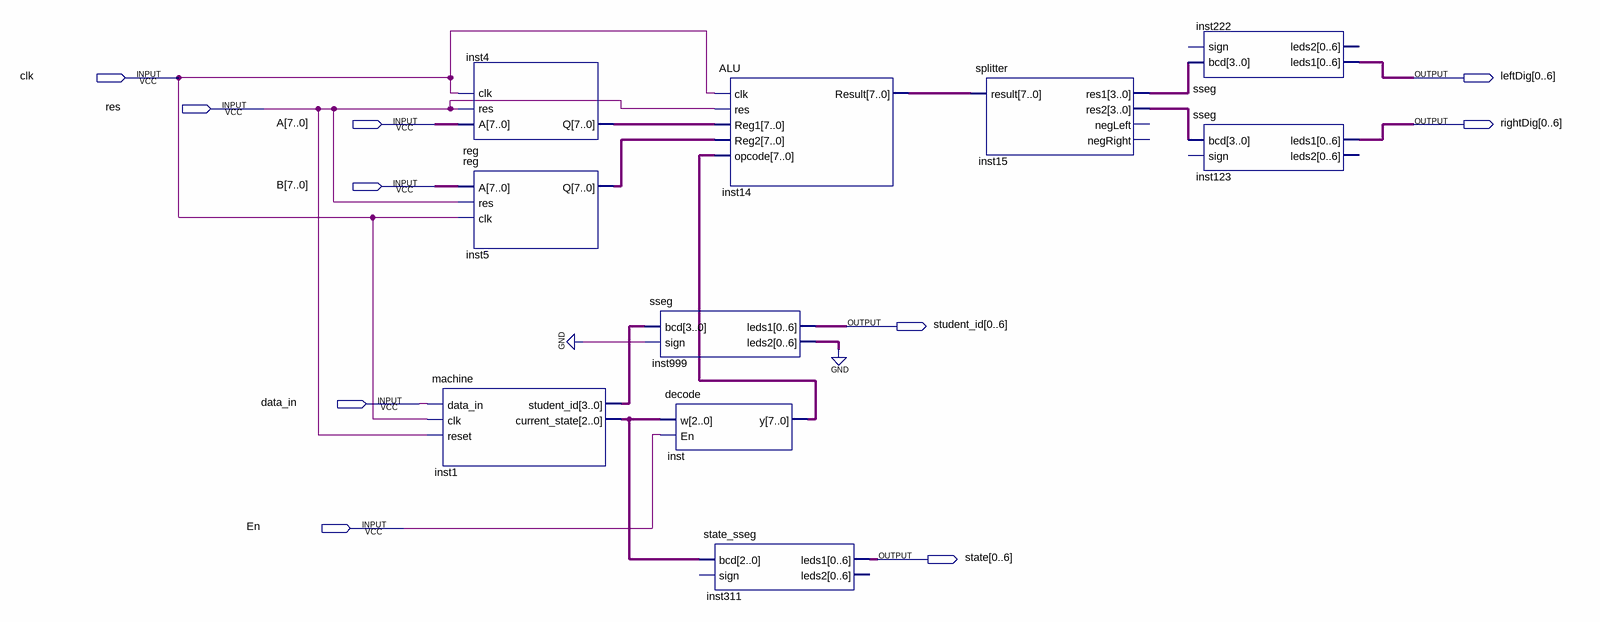
[diagram p0: schematic sheet]
// Quartus schematic CPU.bdf as structural Verilog: 10 symbols, 10 pins
module CPU (
  input  clk,
  input  res,
  input  [7:0] A,
  input  [7:0] B,
  input  data_in,
  input  En,
  output [0:6] leftDig,
  output [0:6] rightDig,
  output [0:6] student_id,
  output [0:6] state
);

  wire [2:0] inst1_current_state;
  wire [3:0] inst1_student_id, inst15_res1, inst15_res2;
  wire [6:0] inst999_leds2;
  wire [7:0] inst4_q, inst5_q, inst14_result, inst_y;

  \reg  inst4 (.A(A), .res(res), .clk(clk), .Q(inst4_q));
  \reg  inst5 (.A(B), .res(res), .clk(clk), .Q(inst5_q));
  machine inst1 (
    .data_in(data_in), .clk(clk), .reset(res), .student_id(inst1_student_id),
    .current_state(inst1_current_state));
  sseg inst999 (.bcd(inst1_student_id), .sign(1'b0), .leds1(student_id), .leds2(inst999_leds2));
  decode inst (.w(inst1_current_state), .En(En), .y(inst_y));
  ALU inst14 (.clk(clk), .res(res), .Reg1(inst4_q), .Reg2(inst5_q), .opcode(inst_y), .Result(inst14_result));
  state_sseg inst311 (.bcd(inst1_current_state), .leds1(state));  // open: sign, leds2
  splitter inst15 (.result(inst14_result), .res1(inst15_res1), .res2(inst15_res2));  // open: negLeft, negRight
  sseg inst222 (.bcd(inst15_res1), .leds1(leftDig));  // open: sign, leds2
  sseg inst123 (.bcd(inst15_res2), .leds1(rightDig));  // open: sign, leds2
  // also tied to GND on the sheet: {inst999_leds2[0], inst999_leds2[1], inst999_leds2[2], inst999_leds2[3], inst999_leds2[4], inst999_leds2[5], inst999_leds2[6]}
endmodule
